# EAGLE design asserv (EAGLE 4.16)
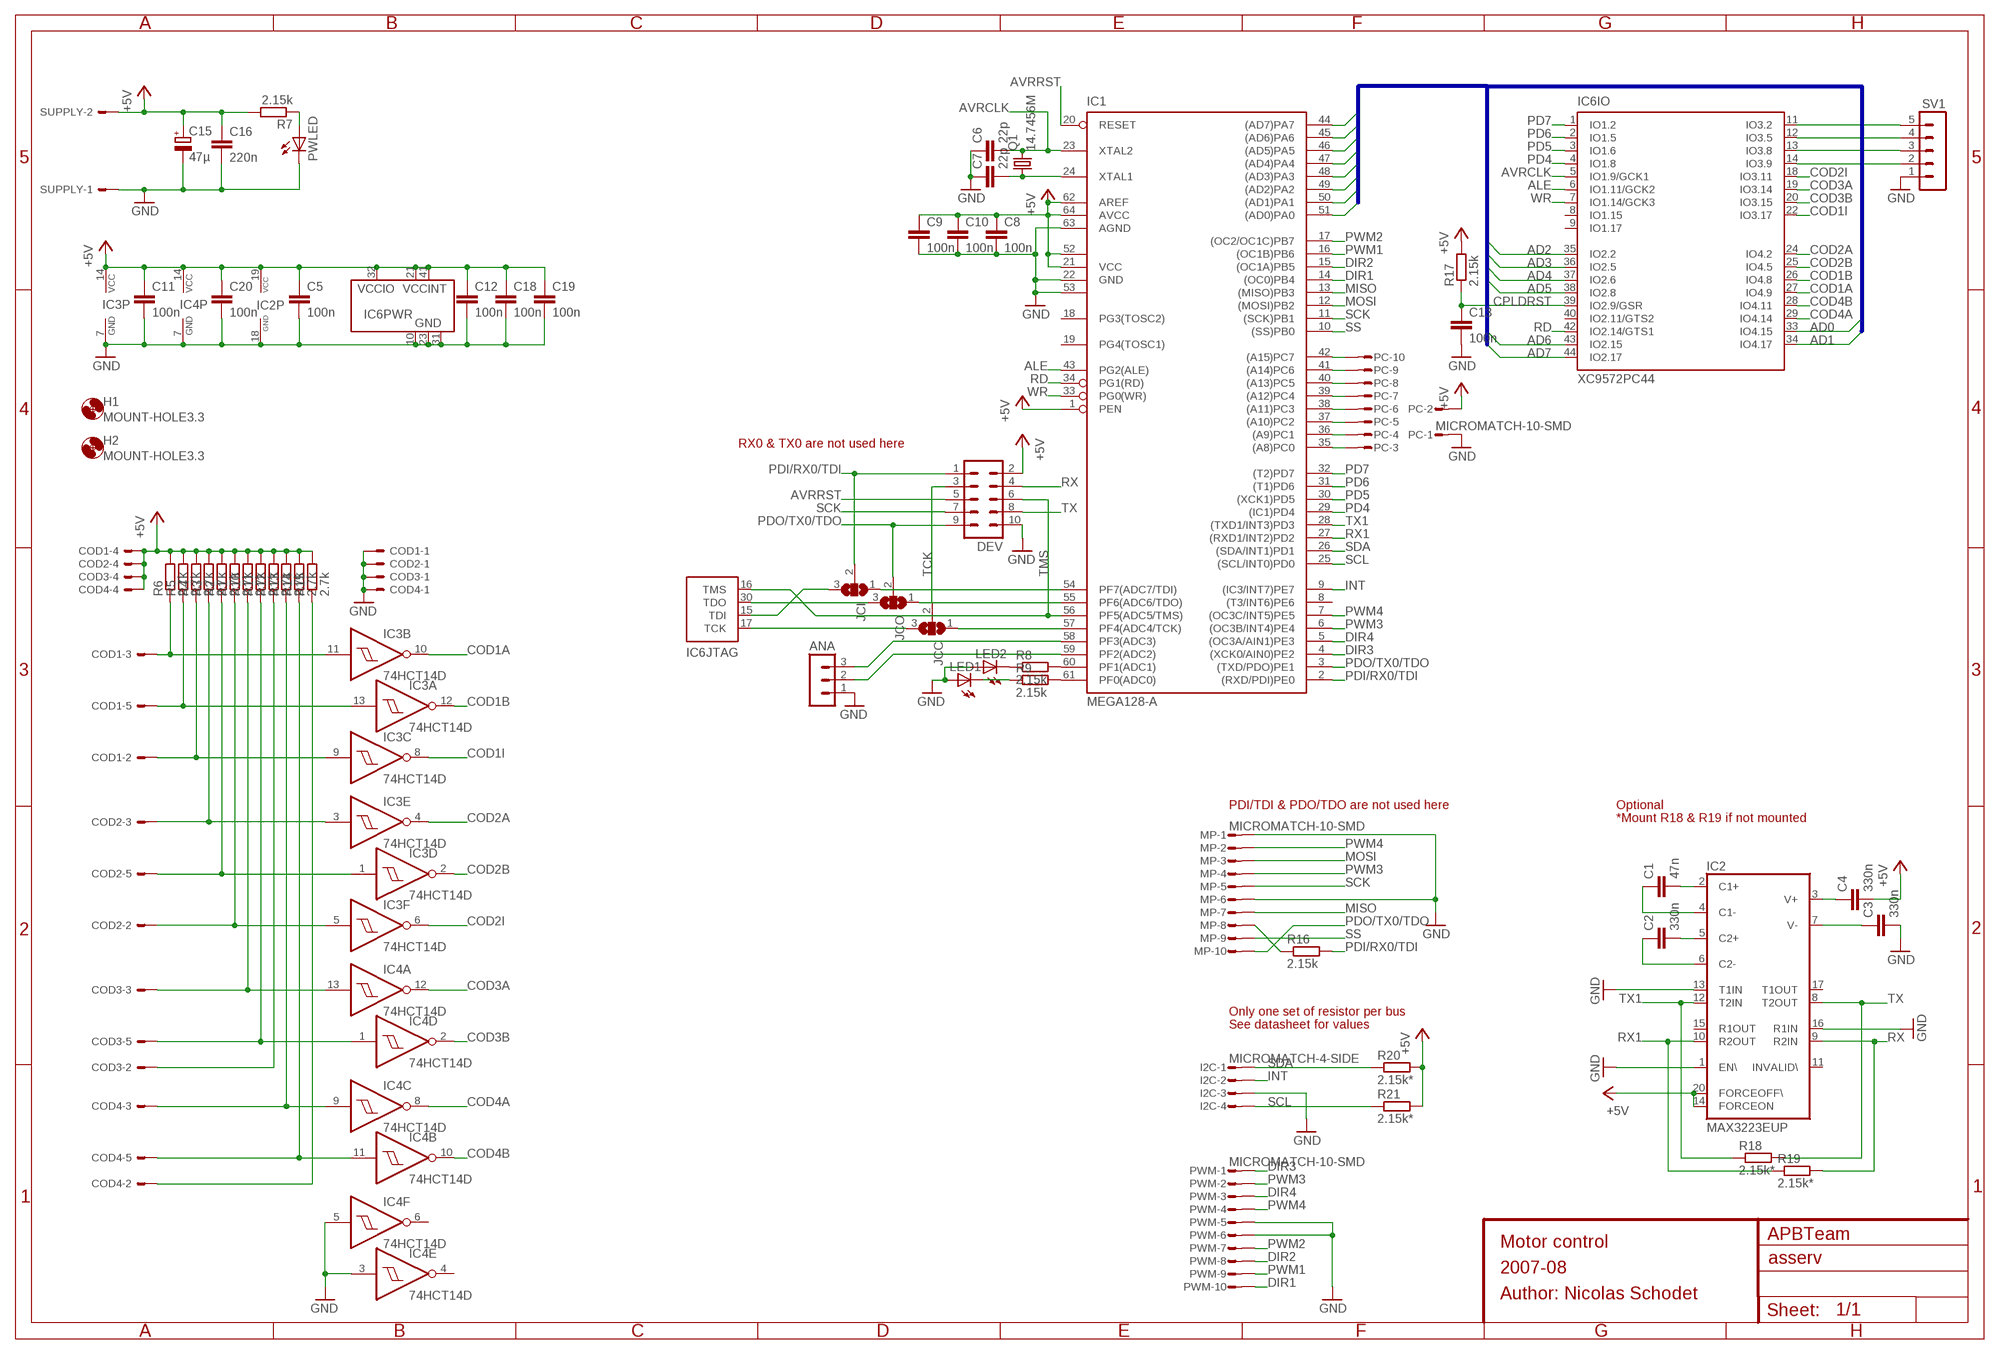
[diagram p0: schematic, sheet 1]

## Parts
ANA  MA03-1  [MA03-1]
C1  47n  C-EUC0603  [C0603]
C2  330n  C-EUC0603  [C0603]
C3  330n  C-EUC0603  [C0603]
C4  330n  C-EUC0603  [C0603]
C5  100n  C-EUC0603  [C0603]
C6  22p  C-EUC0603  [C0603]
C7  22p  C-EUC0603  [C0603]
C8  100n  C-EUC0603  [C0603]
C9  100n  C-EUC0603  [C0603]
C10  100n  C-EUC0603  [C0603]
C11  100n  C-EUC0603  [C0603]
C12  100n  C-EUC0603  [C0603]
C13  100n  C-EUC0603  [C0603]
C15  47µ  CPOL-EUC  [PANASONIC_C]
C16  220n  C-EUC0603  [C0603]
C18  100n  C-EUC0603  [C0603]
C19  100n  C-EUC0603  [C0603]
C20  100n  C-EUC0603  [C0603]
COD1  EC1X05  [EC1X05]
COD2  EC1X05  [EC1X05]
COD3  EC1X05  [EC1X05]
COD4  EC1X05  [EC1X05]
DEV  ML10L  [ML10L]
H1  MOUNT-HOLE3.3  [3,3]
H2  MOUNT-HOLE3.3  [3,3]
I2C  MICROMATCH-4-SIDE  [MICROMATCH-4-SIDE]
IC1  MEGA128-A  [TQFP64]
IC2  MAX3223EUP  [TSSOP20]
IC3  74HCT14D  [SO14]
IC4  74HCT14D  [SO14]
IC6  XC9572PC44  [PLCC44]
JCC  SJ2W  [SJ_2]
JCI  SJ2W  [SJ_2]
JCO  SJ2W  [SJ_2]
LED1  LEDSMT1206  [1206]
LED2  LEDSMT1206  [1206]
MP  MICROMATCH-10-SMD  [MICROMATCH-10-SMD]
PC  MICROMATCH-10-SMD  [MICROMATCH-10-SMD]
PWLED  LEDSMT1206  [1206]
PWM  MICROMATCH-10-SMD  [MICROMATCH-10-SMD]
Q1  14.7456M  CRYTALHC49U70  [HC49U70]
R1  2.7k  R-EU_R0603  [R0603]
R2  2.7k  R-EU_R0603  [R0603]
R3  2.7k  R-EU_R0603  [R0603]
R4  2.7k  R-EU_R0603  [R0603]
R5  2.7k  R-EU_R0603  [R0603]
R6  2.7k  R-EU_R0603  [R0603]
R7  2.15k  R-EU_R0603  [R0603]
R8  2.15k  R-EU_R0603  [R0603]
R9  2.15k  R-EU_R0603  [R0603]
R10  2.7k  R-EU_R0603  [R0603]
R11  2.7k  R-EU_R0603  [R0603]
R12  2.7k  R-EU_R0603  [R0603]
R13  2.7k  R-EU_R0603  [R0603]
R14  2.7k  R-EU_R0603  [R0603]
R15  2.7k  R-EU_R0603  [R0603]
R16  2.15k  R-EU_R0603  [R0603]
R17  2.15k  R-EU_R0603  [R0603]
R18  2.15k*  R-EU_R0603  [R0603]
R19  2.15k*  R-EU_R0603  [R0603]
R20  2.15k*  R-EU_R0603  [R0603]
R21  2.15k*  R-EU_R0603  [R0603]
SUPPLY  EC1X02  [EC1X02]
SV1  MA05-1  [MA05-1]

## Nets
+5V [supply]: C4.2 C5.1 C8.1 C9.1 C10.1 C11.1 C12.1 C15.+ C16.1 C18.1 C19.1 C20.1 COD1.4 COD2.4 COD3.4 COD4.4 DEV.2 IC1.1(PEN) IC1.21(VCC) IC1.52(VCC1) IC1.62(AREF) IC1.64(AVCC) IC2.14(FORCEON) IC2.19(VCC) IC2.20(FORCEOFF\) IC3.14(P:VCC) IC4.14(P:VCC) IC6.21(PWR:VCCINT) IC6.32(PWR:VCCIO) IC6.41(PWR:VCCINT) PC.2 R1.2 R2.2 R3.2 R4.2 R5.2 R6.2 R7.2 R10.2 R11.2 R12.2 R13.2 R14.2 R15.2 R17.2 R20.2 R21.2 SUPPLY.2
AD0: IC1.51((AD0)PA0) IC6.33(IO:IO4.15)
AD1: IC1.50((AD1)PA1) IC6.34(IO:IO4.17)
AD2: IC1.49((AD2)PA2) IC6.35(IO:IO2.2)
AD3: IC1.48((AD3)PA3) IC6.36(IO:IO2.5)
AD4: IC1.47((AD4)PA4) IC6.37(IO:IO2.6)
AD5: IC1.46((AD5)PA5) IC6.38(IO:IO2.8)
AD6: IC1.45((AD6)PA6) IC6.43(IO:IO2.15)
AD7: IC1.44((AD7)PA7) IC6.44(IO:IO2.17)
ALE: IC1.43(PG2(ALE)) IC6.6(IO:IO1.11/GCK2)
ATCK: IC1.57(PF4(ADC4/TCK)) JCC.1
ATDI: IC1.54(PF7(ADC7/TDI)) JCI.1
ATDO: IC1.55(PF6(ADC6/TDO)) JCO.1
AVRCLK: C6.2 IC1.23(XTAL2) IC6.5(IO:IO1.9/GCK1) Q1.2
AVRRST: DEV.5 IC1.20(RESET)
C0: IC1.35((A8)PC0) PC.3
C1: IC1.36((A9)PC1) PC.4
C2: IC1.37((A10)PC2) PC.5
C3: IC1.38((A11)PC3) PC.6
C4: IC1.39((A12)PC4) PC.7
C5: IC1.40((A13)PC5) PC.8
C6: IC1.41((A14)PC6) PC.9
C7: IC1.42((A15)PC7) PC.10
COD1A: IC3.10(B:O) IC6.27(IO:IO4.9)
COD1B: IC3.12(A:O) IC6.26(IO:IO4.8)
COD1I: IC3.8(C:O) IC6.22(IO:IO3.17)
COD2A: IC3.4(E:O) IC6.24(IO:IO4.2)
COD2B: IC3.2(D:O) IC6.25(IO:IO4.5)
COD2I: IC3.6(F:O) IC6.18(IO:IO3.11)
COD3A: IC4.12(A:O) IC6.19(IO:IO3.14)
COD3B: IC4.2(D:O) IC6.20(IO:IO3.15)
COD4A: IC4.8(C:O) IC6.29(IO:IO4.14)
COD4B: IC4.10(B:O) IC6.28(IO:IO4.11)
CPLDRST: C13.1 IC6.39(IO:IO2.9/GSR) R17.1
DIR1: IC1.14((OC0)PB4) PWM.10
DIR2: IC1.15((OC1A)PB5) PWM.8
DIR3: IC1.4((XCK0/AIN0)PE2) PWM.1
DIR4: IC1.5((OC3A/AIN1)PE3) PWM.3
GND [supply]: ANA.1 C3.2 C5.2 C6.1 C7.1 C8.2 C9.2 C10.2 C11.2 C12.2 C13.2 C15.- C16.2 C18.2 C19.2 C20.2 COD1.1 COD2.1 COD3.1 COD4.1 DEV.10 I2C.3 IC1.22(GND) IC1.53(GND1) IC1.63(AGND) IC2.1(EN\) IC2.13(T1IN) IC2.16(R1IN) IC2.18(GND) IC3.7(P:GND) IC4.3(E:I) IC4.5(F:I) IC4.7(P:GND) IC6.10(PWR:GND) IC6.23(PWR:GND) IC6.31(PWR:GND) LED1.A LED2.A MP.1 MP.6 PC.1 PWLED.C PWM.5 PWM.6 SUPPLY.1 SV1.1
INT: I2C.2 IC1.9((IC3/INT7)PE7)
MC1+: C1.2 IC2.2(C1+)
MC1-: C1.1 IC2.4(C1-)
MC2+: C2.2 IC2.5(C2+)
MC2-: C2.1 IC2.6(C2-)
MISO: IC1.13((MISO)PB3) MP.7
MOSI: IC1.12((MOSI)PB2) MP.3
MV+: C4.1 IC2.3(V+)
MV-: C3.1 IC2.7(V-)
N$1: PWLED.A R7.1
N$2: IC1.60(PF1(ADC1)) R8.2
N$4: ANA.3 IC1.58(PF3(ADC3))
N$5: ANA.2 IC1.59(PF2(ADC2))
N$6: IC6.11(IO:IO3.2) SV1.5
N$7: IC6.12(IO:IO3.5) SV1.4
N$8: COD3.3 IC4.13(A:I) R10.1
N$9: IC6.13(IO:IO3.8) SV1.3
N$10: COD3.5 IC4.1(D:I) R11.1
N$11: C7.2 IC1.24(XTAL1) Q1.1
N$12: COD3.2 R12.1
N$13: IC6.14(IO:IO3.9) SV1.2
N$14: LED2.C R8.1
N$15: IC1.61(PF0(ADC0)) R9.2
N$16: LED1.C R9.1
N$18: COD2.2 IC3.5(F:I) R1.1
N$19: COD1.2 IC3.9(C:I) R4.1
N$21: COD1.3 IC3.11(B:I) R6.1
N$22: COD1.5 IC3.13(A:I) R5.1
N$23: COD2.3 IC3.3(E:I) R3.1
N$24: COD2.5 IC3.1(D:I) R2.1
N$32: COD4.3 IC4.9(C:I) R13.1
N$33: COD4.5 IC4.11(B:I) R14.1
N$41: COD4.2 R15.1
PD4: IC1.29((IC1)PD4) IC6.4(IO:IO1.8)
PD5: IC1.30((XCK1)PD5) IC6.3(IO:IO1.6)
PD6: IC1.31((T1)PD6) IC6.2(IO:IO1.5)
PD7: IC1.32((T2)PD7) IC6.1(IO:IO1.2)
PDI/RX0/TDI: DEV.1 IC1.2((RXD/PDI)PE0) JCI.2 R16.2
PDO/TX0/TDO: DEV.9 IC1.3((TXD/PDO)PE1) JCO.2 MP.10
PWM1: IC1.16((OC1B)PB6) PWM.9
PWM2: IC1.17((OC2/OC1C)PB7) PWM.7
PWM3: IC1.6((OC3B/INT4)PE4) MP.4 PWM.2
PWM4: IC1.7((OC3C/INT5)PE5) MP.2 PWM.4
RD: IC1.34(PG1(RD)) IC6.42(IO:IO2.14/GTS1)
RX: DEV.4 IC2.9(R2IN) R19.2
RX1: IC1.27((RXD1/INT2)PD2) IC2.10(R2OUT) R19.1
SCK: DEV.7 IC1.11((SCK)PB1) MP.5
SCL: I2C.4 IC1.25((SCL/INT0)PD0) R21.1
SDA: I2C.1 IC1.26((SDA/INT1)PD1) R20.1
SS: IC1.10((SS)PB0) MP.9
TCK: DEV.3 JCC.2
TMS: DEV.6 IC1.56(PF5(ADC5/TMS)) IC6.16(JTAG:TMS)
TX: DEV.8 IC2.8(T2OUT) R18.2
TX1: IC1.28((TXD1/INT3)PD3) IC2.12(T2IN) R18.1
TX_SLAVE: MP.8 R16.1
WR: IC1.33(PG0(WR)) IC6.7(IO:IO1.14/GCK3)
XTCK: IC6.17(JTAG:TCK) JCC.3
XTDI: IC6.15(JTAG:TDI) JCI.3
XTDO: IC6.30(JTAG:TDO) JCO.3
Unconnected: IC1.8((T3/INT6)PE6) IC1.18(PG3(TOSC2)) IC1.19(PG4(TOSC1)) IC2.11(INVALID\) IC2.15(R1OUT) IC2.17(T1OUT) IC4.4(E:O) IC4.6(F:O) IC6.8(IO:IO1.15) IC6.9(IO:IO1.17) IC6.40(IO:IO2.11/GTS2)

## Buses
AD[0..7]

## Notes on the sheet
- RX0 & TX0 are not used here
- PDI/TDI & PDO/TDO are not used here | Optional
- *Mount R18 & R19 if not mounted
- Only one set of resistor per bus
- See datasheet for values
- APBTeam
- Motor control
- 2007-08
- Author: Nicolas Schodet

## Library data of the parts
ANA = con-lstb:MA03-1: PIN HEADER
C1-C13 C16 C18-C20 = rcl:C-EU: CAPACITOR, European symbol
C15 = rcl:CPOL-EU: POLARIZED CAPACITOR, European symbol
COD1-COD4 = apbteam_con-amp-he14:E?1X05: Male header simple row, 5 positions
DEV = con-harting-ml:ML10: HARTING
H1 H2 = holes:MOUNT-HOLE: MOUNTING HOLE with drill center marker
I2C = apbteam_con-amp-micromatch:MICROMATCH-4: MicroMaTch 4
IC1 = robot_avr:MEGA128: MICROCONTROLLER 128 Kbytes FLASH 4 Kbytes SRAM 4 Kbytes EEPROM DUAL USART 8-channel 10 bit ADC
IC2 = maxim:MAX3223*: RS-232 Transceivers with AutoShutdown 1µA Supply-Current, True +3V to +5.5V http://dbserv.maxim-ic.com/
IC3 IC4 = 74xx-eu:74*14: Hex schmitt trigger INVERTER
IC6 = apbteam_xilinx-cpld:XC9572*PC44: XC9572 In-System Programmable CPLD 72 macrocells
JCC JCI JCO = jumper:SJ2W: SMD solder JUMPER
LED1 LED2 PWLED = led:LED: LED OSRAM: - CHIPLED LG R971, LG N971, LY N971, LG Q971, LY Q971, LO R971, LY R971 LH N974, LH R974 LS Q976, LO Q976, LY Q976 LO Q996 - Hyper CHIPLED LW Q18S LB Q993, LB Q99A, LB R99A - SideLED LS A670, LO A670, LY A670, LG A670, LP A670 LB A673, LV A673, LT A673, LW A673 LH A674 LY A675 LS A676, LA A676, LO A676, LY A676, LW A676 LS A679, LY A679, LG A679 - Hyper Micro SIDELED® LS Y876, LA Y876, LO Y876, LY Y876 LT Y87S - SmartLED LW L88C, LW L88S LB L89C, LB L89S, LG L890 LS L89K, LO L89K, LY L89K LS L896, LA L896, LO L896, LY L896 - TOPLED LS T670, LO T670, LY T670, LG T670, LP T670 LSG T670, LSP T670, LSY T670, LOP T670, LYG T670 LG T671, LOG T671, LSG T671 LB T673, LV T673, LT T673, LW T673 LH T674 LS T676, LA T676, LO T676, LY T676, LB T676, LH T676, LSB T676, LW T676 LB T67C, LV T67C, LT T67C, LS T67K, LO T67K, LY T67K, LW E67C LS E67B, LA E67B, LO E67B, LY E67B, LB E67C, LV E67C, LT E67C LW T67C LS T679, LY T679, LG T679 LS T770, LO T770, LY T770, LG T770, LP T770 LB T773, LV T773, LT T773, LW T773 LH T774 LS E675, LA E675, LY E675, LS T675 LS T776, LA T776, LO T776, LY T776, LB T776 LHGB T686 LT T68C, LB T68C - Hyper Mini TOPLED® LB M676 - Mini TOPLED Santana® LG M470 LS M47K, LO M47K, LY M47K Source: http://www.osram.convergy.de/
MP PC PWM = apbteam_con-amp-micromatch:MICROMATCH-10: MicroMaTch 10
Q1 = crystal:CRYTAL: CRYSTAL
R1-R21 = rcl:R-EU_: RESISTOR, European symbol
SUPPLY = apbteam_con-amp-he14:E?1X02: Male header simple row, 2 positions
SV1 = con-lstb:MA05-1: PIN HEADER

## Net classes
1 supply: width 0.254 mm

## Board
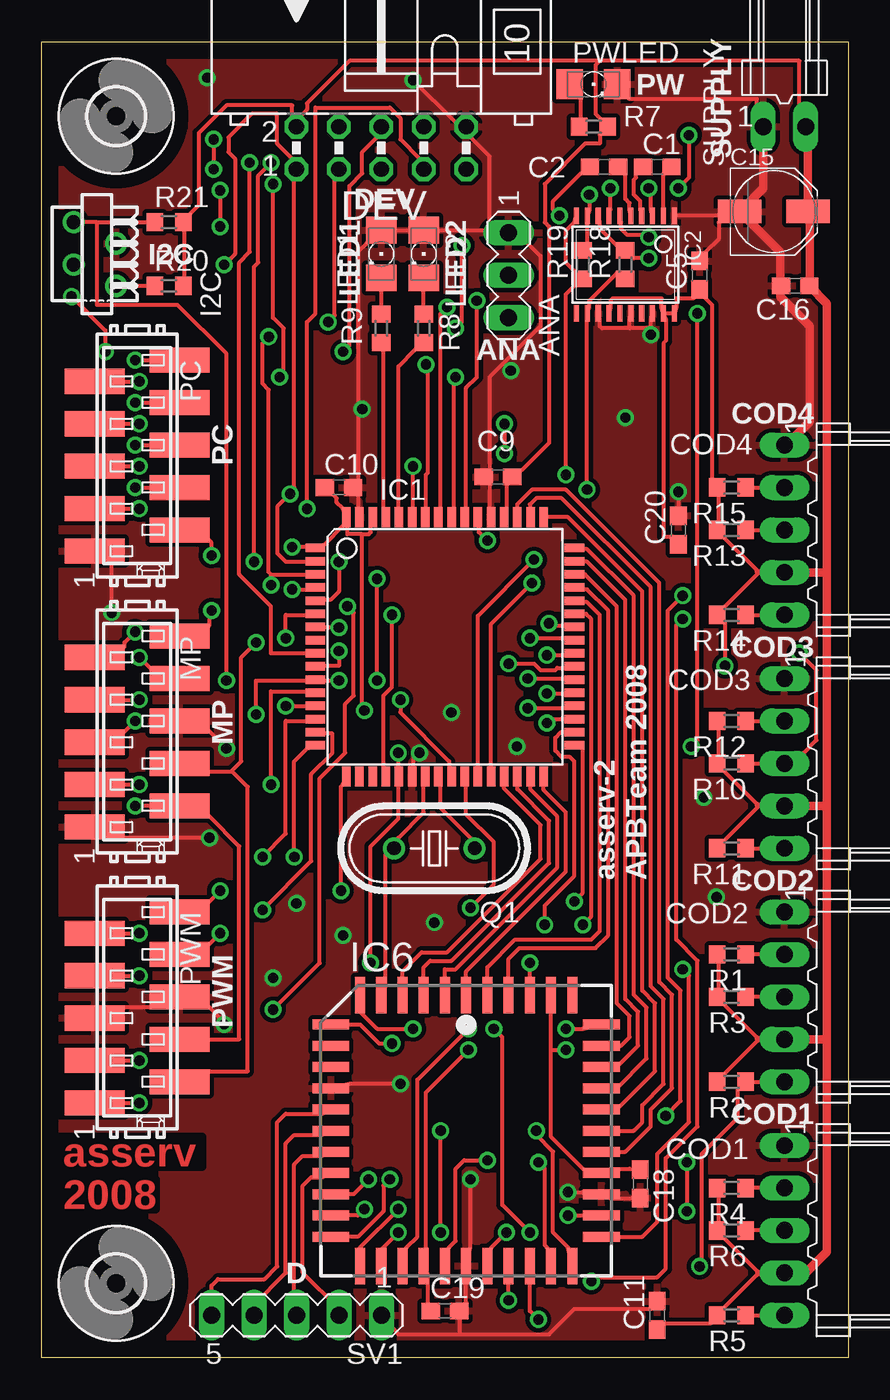
[diagram p1: board, top side]
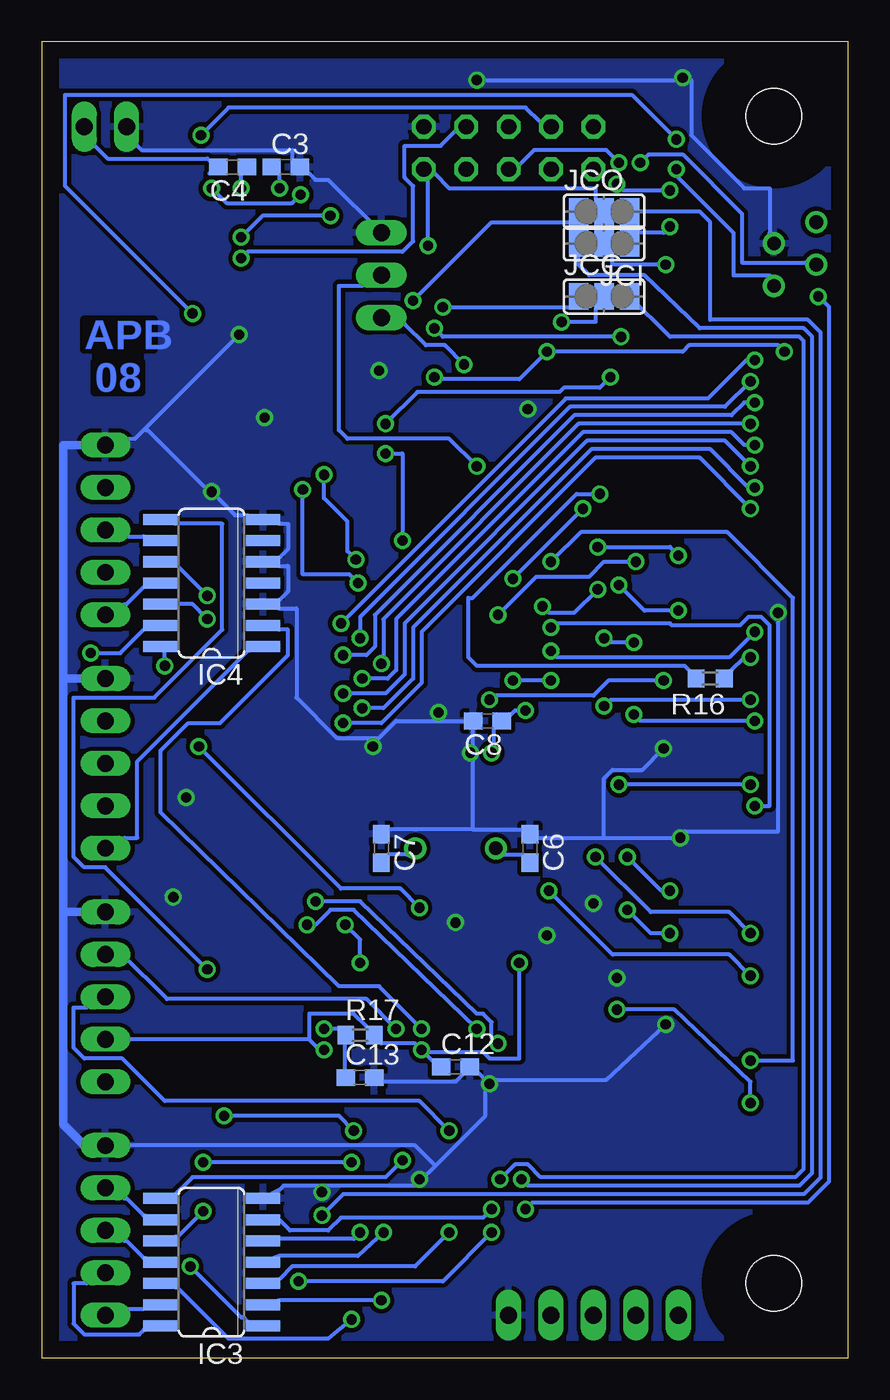
[diagram p2: board, bottom side, seen from below]

Size 48.26 x 78.74 mm. Coordinates in mm from the lower left corner, seen from the top.
Outline: 0,0 0,78.74 48.26,78.74 48.26,0 0,0
Copper layers (1*16): Top 0.035mm / dielectric 1.5mm / Bottom 0.035mm
Design rules "10mils": minimum track width 10mil, minimum drill 24mil, track to track 10mil, track to pad 10mil, pad to pad 10mil, via to via 10mil, smd to smd 10mil, copper to edge 40mil, drill to drill 10mil, minimum pad ring 10mil, minimum via ring 8mil, stop-mask expansion 0mil, vias tented up to drill 0mil, thermal gap 10mil

### Footprints (pad centres in the part's own frame; a part is rotated, then mirrored left to right if it is on the bottom)
MA03-1 = drill 1.016 long: 1 -2.54,0; 2 0,0; 3 2.54,0
C0603 = smd 1.1 x 1: 1 -0.85,0; 2 0.85,0
PANASONIC_C = smd 2.6 x 1.4: + 2.05,0; - -2.05,0
EC1X05 = drill 1 long: 1 -5.08,0; 2 -2.54,0; 3 0,0; 4 2.54,0; 5 5.08,0
ML10L = drill 0.914 octagon: 1 -5.08,-1.27; 2 -5.08,1.27; 3 -2.54,-1.27; 4 -2.54,1.27; 5 0,-1.27; 6 0,1.27; 7 2.54,-1.27; 8 2.54,1.27; 9 5.08,-1.27; 10 5.08,1.27
3,3 = hole 3.3: 0,0
MICROMATCH-4-SIDE = drill 0.813 round: 1 1.905,1.27; 2 0.635,-1.27; 3 -0.635,1.27; 4 -1.905,-1.27
TQFP64 = smd 1.194 x 0.508: 1 -7.76,5.905; 2 -7.76,5.118; 3 -7.76,4.331; 4 -7.76,3.543; 5 -7.76,2.756; 6 -7.76,1.968; 7 -7.76,1.181; 8 -7.76,0.394; 9 -7.76,-0.394; 10 -7.76,-1.181; 11 -7.76,-1.968; 12 -7.76,-2.756; 13 -7.76,-3.543; 14 -7.76,-4.331; 15 -7.76,-5.118; 16 -7.76,-5.905; 33 7.76,-5.905; 34 7.76,-5.118; 35 7.76,-4.331; 36 7.76,-3.543; 37 7.76,-2.756; 38 7.76,-1.968; 39 7.76,-1.181; 40 7.76,-0.394; 41 7.76,0.394; 42 7.76,1.181; 43 7.76,1.968; 44 7.76,2.756; 45 7.76,3.543; 46 7.76,4.331; 47 7.76,5.118; 48 7.76,5.905 | smd 0.508 x 1.194: 17 -5.905,-7.76; 18 -5.118,-7.76; 19 -4.331,-7.76; 20 -3.543,-7.76; 21 -2.756,-7.76; 22 -1.968,-7.76; 23 -1.181,-7.76; 24 -0.394,-7.76; 25 0.394,-7.76; 26 1.181,-7.76; 27 1.968,-7.76; 28 2.756,-7.76; 29 3.543,-7.76; 30 4.331,-7.76; 31 5.118,-7.76; 32 5.905,-7.76; 49 5.905,7.76; 50 5.118,7.76; 51 4.331,7.76; 52 3.543,7.76; 53 2.756,7.76; 54 1.968,7.76; 55 1.181,7.76; 56 0.394,7.76; 57 -0.394,7.76; 58 -1.181,7.76; 59 -1.968,7.76; 60 -2.756,7.76; 61 -3.543,7.76; 62 -4.331,7.76; 63 -5.118,7.76; 64 -5.905,7.76
TSSOP20 = smd 0.305 x 0.991: 1 -2.925,-2.918; 2 -2.275,-2.918; 3 -1.625,-2.918; 4 -0.975,-2.918; 5 -0.325,-2.918; 6 0.325,-2.918; 7 0.975,-2.918; 8 1.625,-2.918; 9 2.275,-2.918; 10 2.925,-2.918; 11 2.925,2.918; 12 2.275,2.918; 13 1.625,2.918; 14 0.975,2.918; 15 0.325,2.918; 16 -0.325,2.918; 17 -0.975,2.918; 18 -1.625,2.918; 19 -2.275,2.918; 20 -2.925,2.918
SO14 = smd 0.66 x 2.032: 1 -3.81,-3.073; 2 -2.54,-3.073; 3 -1.27,-3.073; 4 0,-3.073; 5 1.27,-3.073; 6 2.54,-3.073; 7 3.81,-3.073; 8 3.81,3.073; 9 2.54,3.073; 10 1.27,3.073; 11 0,3.073; 12 -1.27,3.073; 13 -2.54,3.073; 14 -3.81,3.073
PLCC44 = smd 0.6 x 2.2: 1 0,8.1; 2 -1.27,8.1; 3 -2.54,8.1; 4 -3.81,8.1; 5 -5.08,8.1; 6 -6.35,8.1; 18 -6.35,-8.1; 19 -5.08,-8.1; 20 -3.81,-8.1; 21 -2.54,-8.1; 22 -1.27,-8.1; 23 0,-8.1; 24 1.27,-8.1; 25 2.54,-8.1; 26 3.81,-8.1; 27 5.08,-8.1; 28 6.35,-8.1; 40 6.35,8.1; 41 5.08,8.1; 42 3.81,8.1; 43 2.54,8.1; 44 1.27,8.1 | smd 2.2 x 0.6: 7 -8.1,6.35; 8 -8.1,5.08; 9 -8.1,3.81; 10 -8.1,2.54; 11 -8.1,1.27; 12 -8.1,0; 13 -8.1,-1.27; 14 -8.1,-2.54; 15 -8.1,-3.81; 16 -8.1,-5.08; 17 -8.1,-6.35; 29 8.1,-6.35; 30 8.1,-5.08; 31 8.1,-3.81; 32 8.1,-2.54; 33 8.1,-1.27; 34 8.1,0; 35 8.1,1.27; 36 8.1,2.54; 37 8.1,3.81; 38 8.1,5.08; 39 8.1,6.35
SJ_2 = smd 1.168 x 1.6: 1 -1.524,0; 2 0,0; 3 1.524,0
1206 = smd 1.6 x 1.803: A -1.422,0; C 1.422,0
MICROMATCH-10-SMD = smd 1.5 x 3.58: 1 5.715,-2.54; 2 4.445,2.54; 3 3.175,-2.54; 4 1.905,2.54; 5 0.635,-2.54; 6 -0.635,2.54; 7 -1.905,-2.54; 8 -3.175,2.54; 9 -4.445,-2.54; 10 -5.715,2.54
HC49U70 = drill 0.813 round: 1 -2.413,0; 2 2.413,0
R0603 = smd 1 x 1.1: 1 -0.85,0; 2 0.85,0
EC1X02 = drill 1 long: 1 -1.27,0; 2 1.27,0
MA05-1 = drill 1.016 long: 1 -5.08,0; 2 -2.54,0; 3 0,0; 4 2.54,0; 5 5.08,0

### Placement (x,y rotation side)
ANA  27.94,64.77 270 top
C1  36.83,71.25 0 top
C2  33.66,71.25 0 top
C3  33.66,71.25 0 bottom
C4  36.83,71.25 180 bottom
C5  39.37,64.77 90 top
C6  19.05,30.48 270 bottom
C7  27.94,30.48 270 bottom
C8  21.59,38.1 180 bottom
C9  27.3,52.7 180 top
C10  17.78,52.07 0 top
C11  36.83,2.54 90 top
C12  23.5,17.4 0 bottom
C13  29.21,16.76 0 bottom
C15  43.81,68.58 0 top
C16  45.09,64.14 180 top
C18  35.81,10.41 270 top
C19  24.13,2.79 0 top
C20  38.1,49.53 90 top
COD1  44.45,7.62 270 top
COD2  44.45,21.59 270 top
COD3  44.45,35.56 270 top
COD4  44.45,49.53 270 top
DEV  20.32,72.39 0 top
H1  4.45,74.3 0 top
H2  4.45,4.45 0 top
I2C  3.17,66.04 270 top
IC1  24.13,42.55 0 top
IC2  34.92,65.41 180 top
IC3  38.1,5.71 90 bottom
IC4  38.1,46.35 90 bottom
IC6  25.4,13.59 0 top
JCC  14.61,63.5 0 bottom
JCI  14.61,66.67 180 bottom
JCO  14.61,68.58 0 bottom
LED1  20.32,66.04 270 top
LED2  22.86,66.04 270 top
MP  5.71,37.47 270 top
PC  5.71,53.98 270 top
PWLED  33.02,76.2 0 top
PWM  5.71,20.95 270 top
Q1  23.5,30.48 180 top
R1  41.27,24.13 180 top
R2  41.27,16.51 180 top
R3  41.27,21.59 180 top
R4  41.27,10.16 180 top
R5  41.27,2.54 180 top
R6  41.27,7.62 180 top
R7  33.02,73.66 0 top
R8  22.86,61.59 270 top
R9  20.32,61.59 270 top
R10  41.27,35.56 180 top
R11  41.27,30.48 180 top
R12  41.27,38.1 180 top
R13  41.27,49.53 180 top
R14  41.27,44.45 180 top
R15  41.27,52.07 180 top
R16  8.26,40.64 180 bottom
R17  29.21,19.3 0 bottom
R18  34.92,65.41 90 top
R19  32.38,65.41 90 top
R20  7.62,64.14 0 top
R21  7.62,67.94 0 top
SUPPLY  44.45,73.66 0 top
SV1  15.24,2.54 180 top

### Tracks (layer width: path | path; a pad name or v marks a point on that pad's centre or on a via)
+5V  (via drill 0.61)
  Top 0.254: v21.34,36.2 21.34,35.31 IC1.21 21.34,34.29 21.34,32.26 19.68,30.61 v19.68,23.62 | C10.1 17.4,51.69 17.65,51.44 17.65,51.18 18.03,50.8 IC1.64 | IC1.64 18.03,49.78 16.89,48.64 IC1.1 15.88,48.51 v14.99,48.51 | 19.18,49.28 18.29,49.28 18.29,49.78 IC1.64 | 19.18,49.28 19.56,49.28 19.68,49.4 19.68,49.78 IC1.62 | v19.3,38.73 19.18,38.86 19.18,49.28 | v10.16,48.01 10.16,48.77 10.03,48.9 PC.2 | C18.1 35.18,11.3 34.04,11.3 IC6.32 32.38,11.3 30.48,13.21 30.48,18.41 | 30.48,18.41 IC6.41 | C19.1 23.11,3.3 23.11,4.95 IC6.21 22.99,6.6 22.99,15.88 v25.53,18.41 | 30.48,18.41 v31.37,18.41 | IC2.14 34.04,62.87 34.04,63.25 34.16,63.37 37.08,63.37 37.08,62.87 IC2.19 | IC2.19 37.34,62.48 37.72,62.48 IC2.20 37.97,62.87 37.97,63.37 38.99,63.37 C5.1 39.75,63.37 40.13,62.99 40.13,52.58 R15.2 40.51,51.56 40.51,50.04 R13.2 40.89,49.02 42.8,47.12 42.8,46.99 42.86,46.93 | C20.1 37.72,49.15 37.21,49.15 37.21,60.71 37.34,60.83 37.34,62.1 IC2.19 | R20.2 8.51,64.64 8.51,67.44 R21.2 8.89,68.45 9.4,68.96 9.4,73.28 11.05,74.93 14.99,74.93 14.99,74.3 DEV.2 15.49,74.3 15.88,74.68 15.88,75.06 18.41,77.6 33.27,77.6 33.34,77.53 | C11.1 37.21,2.03 40.01,2.03 R5.2 40.89,3.05 42.8,4.95 42.8,5.08 42.86,5.14 | IC1.52 27.81,50.8 27.81,52.32 C9.1 28.7,53.09 30.35,54.74 30.35,67.69 30.1,67.94 30.1,70.23 32.51,72.64 33.4,72.64 33.4,73.15 R7.2 33.4,74.17 33.15,74.42 33.15,77.34 33.34,77.53 | R12.2 40.51,37.59 40.51,36.07 R10.2 40.89,35.05 42.8,33.15 42.8,33.02 42.86,32.96 | R1.2 40.51,23.62 40.51,22.1 R3.2 40.89,21.08 42.8,19.18 42.8,19.05 42.86,18.99 | R4.2 40.51,9.65 40.51,8.13 R6.2 40.89,7.11 42.86,5.14
  Top 0.254: 42.86,18.99 43.05,19.18 COD2.4 | 42.86,18.99 40.89,17.02 R2.2 | 42.86,32.96 43.05,33.15 COD3.4 | 42.86,32.96 40.89,30.99 R11.2 | 42.86,46.93 43.05,47.12 COD4.4 | 42.86,46.93 40.89,44.96 R14.2 40.89,43.94 v40.89,41.4 | 33.34,77.53 33.4,77.6 45.34,77.6 45.34,75.06 SUPPLY.2 | 42.86,5.14 43.05,4.95 COD1.4
  Top 0.508: 46.99,46.99 COD4.4 | 46.99,33.02 46.99,46.99 | 46.99,33.02 COD3.4 | 46.99,19.05 46.99,33.02 | COD2.4 46.99,19.05 | 46.99,19.05 46.99,6.35 45.72,5.08 COD1.4 | SUPPLY.2 45.85,73.66 45.85,68.58 C15.+ 45.97,68.47 45.97,64.14 C16.1 46.99,63.08 46.99,46.99
  Bottom 0.254: v21.34,36.2 21.21,36.2 21.21,37.72 C8.1 20.19,38.48 19.94,38.73 v19.3,38.73 | v10.16,48.01 10.67,48.51 v14.99,48.51 | v25.53,18.41 25.91,18.8 27.94,18.8 R17.2 28.83,19.81 29.59,20.57 32.26,20.57 32.26,19.05 | v25.53,18.41 24.89,17.78 C12.1 | 38.23,70.87 C4.2 38.23,71.63 38.35,71.75 44.32,71.75 45.09,72.52 SUPPLY.2 | IC3.14 42.16,1.65 42.42,1.4 45.72,1.4 46.35,2.03 46.35,4.45 45.59,4.45 COD1.4 | v40.89,41.4 40.89,42.29 IC4.14 | 32.26,19.05 COD2.4 | v19.68,23.62 19.68,17.91 21.46,17.91 21.84,18.29 25.15,18.29 v25.53,18.41 | v31.37,18.41 31.62,18.41 32.26,19.05
AD0
  Top 0.254: IC6.33 34.92,12.32 36.45,13.84 36.45,14.86 37.72,16.13 37.72,21.72 36.96,22.48 36.96,46.35 31.37,51.94 29.34,51.94 28.45,51.05 28.45,50.29 IC1.51
AD1
  Top 0.254: IC6.34 35.43,13.59 35.94,14.1 35.94,15.11 37.21,16.38 37.21,21.46 36.45,22.23 36.45,46.1 31.11,51.44 29.59,51.44 29.21,51.05 29.21,50.29 29.22,50.3 IC1.50
AD2
  Top 0.254: IC6.35 34.42,14.86 36.7,17.14 36.7,21.21 35.94,21.97 35.94,45.85 31.5,50.29 30.1,50.29 30.09,50.3 IC1.49
AD3
  Top 0.254: IC6.36 34.42,16.13 36.2,17.91 36.2,20.95 35.43,21.72 35.43,45.59 32.64,48.39 31.88,48.39 31.89,48.4 IC1.48
AD4
  Top 0.254: IC6.37 34.42,17.4 35.69,18.67 35.69,20.7 34.92,21.46 34.92,45.34 32.64,47.62 31.88,47.62 31.89,47.64 IC1.47
AD5
  Top 0.254: IC6.38 34.67,18.67 35.18,19.18 35.18,20.45 34.42,21.21 34.42,44.96 32.51,46.86 31.88,46.86 IC1.46
AD6
  Top 0.254: IC6.43 27.94,23.88 28.57,24.51 33.15,24.51 33.91,25.27 33.91,44.7 32.64,45.97 31.88,45.97 31.89,45.99 IC1.45
AD7
  Top 0.254: IC1.44 31.98,45.21 32.64,45.21 33.4,44.45 33.4,25.53 32.89,25.02 28.32,25.02 26.67,23.37 IC6.44
ALE  (via drill 0.61)
  Top 0.254: IC1.43 32.58,44.51 32.89,44.2 32.89,26.42 v32.38,25.91 | 18.92,21.46 18.94,21.45 IC6.6 19.05,20.7 20.07,19.68 v22.23,19.68
  Bottom 0.254: v32.38,25.91 31.88,25.91 30.99,26.8 29.59,26.8 v22.23,19.68
ATCK  (via drill 0.61)
  Top 0.254: v24.26,62.87 23.88,62.48 23.88,50.8 IC1.57
  Bottom 0.254: v24.26,62.87 16.64,62.87 JCC.1
ATDI  (via drill 0.61)
  Top 0.254: v26.67,48.9 26.16,49.4 26.16,49.78 IC1.54 | v27.69,55.88 v27.69,54.1 | v14.22,58.67 14.48,58.93 14.48,61.59 13.84,62.23 v13.84,70.23 | v10.67,69.85 v10.67,67.69
  Bottom 0.254: v26.67,48.9 26.67,54.1 v27.69,54.1 | v27.69,55.88 25.78,57.78 17.27,57.78 17.02,58.04 14.86,58.04 v14.22,58.67 | v13.84,70.23 13.46,69.85 v10.67,69.85 | v10.67,67.69 11.05,67.31 12.57,67.31 JCI.1
ATDO  (via drill 0.61)
  Top 0.254: v26.04,63.25 26.04,58.67 25.4,58.04 25.4,50.8 IC1.55
  Bottom 0.254: v26.04,63.25 21.34,67.94 16.64,67.94 JCO.1
AVRCLK
  Top 0.254: IC1.23 22.86,34.29 22.86,32.64 21.34,31.11 Q1.2 20.57,30.1 20.57,22.23 IC6.5
  Bottom 0.254: C6.2 19.43,30.1 20.57,30.1 Q1.2
AVRRST  (via drill 0.61)
  Top 0.254: v20.95,44.45 20.95,40.13 20.45,39.62 20.45,35.31 IC1.20 | v12.7,47.62 12.7,65.28 12.95,65.53 12.95,70.74 v13.72,71.5
  Bottom 0.254: v20.95,44.45 18.67,46.74 15.49,46.74 14.61,47.62 v12.7,47.62 | v13.72,71.5 14.48,72.26 18.8,72.26 19.68,71.37 DEV.5
C0  (via drill 0.61)
  Top 0.254: v30.23,37.97 30.48,38.23 31.11,38.23 31.13,38.21 IC1.35 | PC.3 v5.84,50.8
  Bottom 0.254: v30.23,37.97 27.94,37.97 25.53,40.39 25.53,43.43 15.11,53.85 8.89,53.85 v5.84,50.8
C1  (via drill 0.61)
  Top 0.254: IC1.36 32.03,38.86 v29.08,38.86 | v5.59,52.07 PC.4
  Bottom 0.254: v29.08,38.86 27.81,38.86 26.04,40.64 26.04,43.69 15.37,54.36 8.26,54.36 5.97,52.07 v5.59,52.07
C2  (via drill 0.61)
  Top 0.254: v30.23,39.75 31.37,39.75 IC1.37 | PC.5 v5.84,53.34
  Bottom 0.254: v30.23,39.75 27.69,39.75 26.54,40.89 26.54,43.94 15.62,54.86 7.37,54.86 v5.84,53.34
C3  (via drill 0.61)
  Top 0.254: v29.08,40.64 31.37,40.64 IC1.38 | v5.59,54.61 PC.6
  Bottom 0.254: v29.08,40.64 27.56,40.64 27.05,41.15 27.05,44.2 15.88,55.37 6.99,55.37 6.22,54.61 v5.59,54.61
C4  (via drill 0.61)
  Top 0.254: PC.7 v5.84,55.88 | IC1.39 31.8,41.27 30.86,41.27 30.73,41.15 29.84,41.15 29.46,41.53 v27.94,41.53
  Bottom 0.254: v5.84,55.88 16.13,55.88 27.81,44.2 27.81,41.66 v27.94,41.53
C5  (via drill 0.61)
  Top 0.254: v30.23,42.04 31.37,42.04 IC1.40 | v5.59,57.15 PC.8
  Bottom 0.254: v30.23,42.04 28.83,42.04 28.32,42.55 28.32,44.45 16.38,56.39 6.99,56.39 6.22,57.15 v5.59,57.15
C6  (via drill 0.61)
  Top 0.254: IC1.41 31.77,43.05 v29.21,43.05 | PC.9 v5.84,58.42
  Bottom 0.254: v29.21,43.05 29.21,44.32 16.64,56.9 7.37,56.9 v5.84,58.42
C7  (via drill 0.61)
  Top 0.254: IC1.42 31.8,43.81 30.48,43.81 v30.35,43.94 | v5.59,59.69 PC.10
  Bottom 0.254: v30.35,43.94 16.89,57.4 8.38,57.4 6.1,59.69 v5.59,59.69
COD1A  (via drill 0.61)
  Top 0.254: v29.72,11.68 30.1,11.3 30.1,6.73 30.23,6.6 IC6.27 | v38.61,11.68 v38.61,8.76
  Bottom 0.254: v29.72,11.68 v38.61,11.68 | v38.61,8.76 40.13,7.24 40.26,7.24 IC3.10
COD1B  (via drill 0.61)
  Top 0.254: v29.72,2.29 29.21,2.79 IC6.26
  Bottom 0.254: v29.72,2.29 31.11,1.14 37.08,1.14 40.13,4.19 40.26,4.19 IC3.12
COD1I  (via drill 0.61)
  Top 0.254: v26.67,11.81 25.27,11.81 24.77,11.3 24.77,6.99 24.38,6.6 IC6.22
  Bottom 0.254: v26.67,11.81 27.69,10.79 39.24,10.79 40.51,9.53 IC3.8
COD2A  (via drill 0.61)
  Top 0.254: v27.81,7.49 26.92,6.6 IC6.24
  Bottom 0.254: v27.81,7.49 29.34,6.1 34.04,6.1 IC3.4
COD2B  (via drill 0.61)
  Top 0.254: v27.94,3.43 IC6.25
  Bottom 0.254: v27.94,3.43 34.04,3.43 IC3.2
COD2I  (via drill 0.61)
  Top 0.254: v21.34,8.89 19.05,6.6 IC6.18 19.05,5.71
  Bottom 0.254: v21.34,8.89 21.84,8.38 30.35,8.38 31.11,7.62 33.4,7.62 34.04,8.26 IC3.6
COD3A  (via drill 0.61)
  Top 0.254: v38.35,44.2 37.97,43.81 37.97,25.02 39.24,23.75 39.24,13.84 37.34,11.94 37.34,5.33 36.83,4.83 33.15,4.83 v32.89,4.57 | v21.34,7.49 20.32,6.48 IC6.19
  Bottom 0.254: IC4.12 39.24,45.09 v38.35,44.2 | v32.89,4.57 24.26,4.57 v21.34,7.49
COD3B  (via drill 0.61)
  Top 0.254: v25.53,19.68 22.48,16.64 22.48,7.24 21.84,6.6 IC6.20
  Bottom 0.254: v25.53,19.68 28.07,22.23 30.48,22.23 41.15,32.64 41.15,36.32 39.5,37.97 37.59,37.97 33.53,42.04 33.53,43.56 34.04,43.56 IC4.2
COD4A  (via drill 0.61)
  Top 0.254: v38.35,23.24 38.73,22.86 38.73,14.1 36.83,12.19 36.83,8.13 35.94,7.24 IC6.29
  Bottom 0.254: v38.35,23.24 44.45,29.34 45.72,29.34 46.35,29.97 46.35,39.5 41.53,39.5 37.47,43.56 37.47,49.91 40.26,49.91 IC4.8
COD4B  (via drill 0.61)
  Top 0.254: v29.59,13.59 29.59,13.34 30.61,12.32 30.61,7.49 31.5,6.6 IC6.28 | v37.34,14.48 38.23,15.37 38.23,21.97 37.47,22.73 37.47,44.7 v38.35,45.59
  Bottom 0.254: v29.59,13.59 30.48,14.48 v37.34,14.48 | v38.35,45.59 40.13,47.37 40.26,47.37 IC4.10
CPLDRST  (via drill 0.61)
  Top 0.254: v31.37,19.68 32.38,19.68 IC6.39
  Bottom 0.254: C13.1 30.1,17.14 30.1,18.8 R17.1 30.48,19.68 v31.37,19.68
DIR1  (via drill 0.61)
  Top 0.254: v13.21,29.97 14.61,31.37 14.61,38.1 15.88,38.1 IC1.14 | v10.67,27.94 10.03,27.3 PWM.10
  Bottom 0.254: v13.21,29.97 11.18,27.94 v10.67,27.94
DIR2  (via drill 0.61)
  Top 0.254: v13.21,26.8 16.13,29.72 16.13,34.92 17.4,36.2 17.4,37.34 16.89,37.34 IC1.15 | v10.67,25.4 10.03,24.77 PWM.8
  Bottom 0.254: v13.21,26.8 11.81,25.4 v10.67,25.4
DIR3  (via drill 0.61)
  Top 0.254: v14.99,45.97 15.88,45.97 IC1.4 | PWM.1 v5.84,15.24 | v18.29,44.96 18.67,44.58 18.67,39.62 18.16,39.12 18.16,36.2 16.64,34.67 16.64,23.62 v13.84,20.83
  Bottom 0.254: v14.99,45.97 16.38,44.58 17.91,44.58 v18.29,44.96 | v5.84,15.24 5.84,16.51 10.41,20.83 v13.84,20.83
DIR4  (via drill 0.61)
  Top 0.254: v17.78,47.62 17.78,45.85 17.27,45.34 16.89,45.34 IC1.5 | PWM.3 v5.84,17.78
  Bottom 0.254: v17.78,47.62 16,49.4 7.24,49.4 3.3,45.47 3.3,17.78 v5.84,17.78
GND  (via drill 0.61)
  Top 0.254: 36.58,62.1 IC2.18 36.45,62.1 36.45,61.72 36.39,61.66 | 25.02,1.4 30.35,1.4 31.88,2.92 36.45,2.92 C11.2 | 25.02,1.4 21.34,1.4 SV1.1 | 25.02,1.4 25.02,2.79 C19.2 25.4,3.3 IC6.23 25.65,6.6 v25.65,10.67 | PWM.5 4.95,20.95 6.48,20.95 PWM.6 10.03,20.95 10.92,20.07 v10.92,19.94 | C18.2 35.18,9.53 34.04,9.53 IC6.31 32.38,9.91 v31.5,9.91 | v21.46,16.38 18.41,16.38 IC6.10 | v22.61,36.2 22.23,35.81 22.23,35.31 IC1.22 | v10.03,31.11 4.95,31.11 MP.1 | v4.19,44.58 4.19,47.62 PC.1 | v11.05,36.45 10.03,37.47 MP.6 | v38.1,51.82 C20.2 | 35.18,61.59 33.53,61.59 33.4,61.72 33.4,62.1 IC2.13 | 35.18,61.59 35.18,62.1 IC2.16 | 36.39,61.66 36.32,61.59 35.18,61.59 | IC2.1 37.97,68.33 40.51,68.33 C15.- 40.51,67.94 40.51,66.93 39.75,66.17 C5.2 | PWLED.C 35.18,75.31 42.8,75.31 42.8,75.06 SUPPLY.1 | v36.45,61.21 36.45,61.59 36.39,61.66 | v22.23,76.45 24.77,73.91 DEV.10 25.65,73.03 26.8,71.88 26.8,67.94 ANA.1 | IC1.63 18.92,50.8 18.92,51.69 C10.2 18.92,52.45 18.92,66.17 19.43,66.67 LED1.A 21.21,67.44 21.97,67.44 LED2.A 23.75,67.44 26.54,67.44 ANA.1 | IC1.53 26.8,50.8 26.8,52.32 C9.2 26.8,53.09 26.8,58.67 29.84,61.72 29.84,65.91 29.08,66.67 ANA.1
  Top 0.508: COD4.1 44.45,54.48 45.97,56.01 45.97,61.72 44.2,63.5 44.2,64.14 | SUPPLY.1 43.18,69.98 41.78,68.58 C15.- 44.2,66.15 44.2,64.14 | 44.2,64.14 C16.2
  Bottom 0.254: C12.2 22.48,17.02 | C12.2 22.61,17.4 23.5,16.51 28.07,16.51 28.32,16.76 C13.2 | v21.46,16.38 22.1,17.02 C12.2 | 31.5,10.29 25.91,10.29 25.59,10.6 | 31.5,10.29 33.78,10.29 34.04,10.03 IC3.7 | 24.7,11.49 21.72,14.48 21.72,16 v21.46,16.38 | 25.59,10.6 24.7,11.49 | 31.5,10.29 v31.5,9.91 | v10.92,19.94 14.48,16.64 21.08,16.64 v21.46,16.38 | v25.65,10.67 25.59,10.6 | 22.48,31.62 27.56,31.62 C7.1 | 22.48,31.62 19.43,31.62 C6.1 18.67,31.11 14.61,31.11 | 22.48,36.2 22.48,31.62 | 22.48,36.2 22.48,37.72 C8.2 27.05,38.1 28.07,37.08 30.61,37.08 33.02,39.5 33.02,44.83 34.04,44.83 IC4.3 34.04,45.34 33.53,45.85 33.53,47.37 34.04,47.37 IC4.5 34.04,47.88 33.53,48.39 33.53,49.91 34.04,49.91 IC4.7 35.94,50.42 36.7,50.42 v38.1,51.82 38.48,52.07 41.91,55.5 42.04,55.5 42.1,55.56 | 22.48,36.2 v22.61,36.2 | 14.61,31.11 v10.03,31.11 9.78,31.5 4.19,31.5 v4.19,44.58 | v11.05,36.45 12.32,35.18 14.1,35.18 14.61,34.67 14.61,31.11 | 42.1,55.56 42.67,54.99 43.05,54.99 COD4.1 | 42.1,55.56 v36.45,61.21 | v22.23,76.45 9.4,76.45 9.4,73.15 6.22,69.98 4.7,69.98 4.7,67.31 I2C.3 | ANA.1 31.11,70.48 31.88,70.48 32.26,70.87 C3.2 | SUPPLY.1 42.55,72.52 42.29,72.26 33.27,72.26 33.27,71.63 C3.2 | C3.2 33.15,70.87 | 24.7,11.49 25.91,12.7 COD1.1
  Bottom 0.508: COD1.1 45.72,12.7 46.99,13.97 46.99,26.67 | 46.99,26.67 COD2.1 | 46.99,26.67 46.99,40.64 | 46.99,40.64 COD3.1 | 46.99,40.64 46.99,54.61 COD4.1
  other vias: 23.5,26.04 18.03,25.27 24.51,38.61 28.45,36.58 34.92,56.26 9.91,76.58 28.07,59.05 40.39,27.56 39.62,33.53 13.84,22.73 15.24,27.18 19.18,56.77
  pour Bottom (isolate 0.254): 0,78.74 48.26,78.74 48.26,0 0,0
  pour Top (isolate 0.254): 0,78.74 48.26,78.74 48.26,0 0,0
INT  (via drill 0.61)
  Top 0.254: v12.45,71.5 12.45,66.17 11.81,65.53 11.81,46.86 13.72,44.96 13.72,42.16 15.88,42.16 IC1.9
  Bottom 0.254: v12.45,71.5 11.94,72.01 9.91,72.01 6.35,68.45 6.35,65.53 2.54,65.53 I2C.2
MC1+
  Top 0.254: IC2.2 37.21,68.71 37.21,70.87 C1.2
MC1-
  Top 0.254: IC2.4 35.81,68.71 35.81,69.22 35.43,69.6 35.43,70.48 35.56,70.61 35.56,70.87 C1.1
MC2+
  Top 0.254: IC2.5 35.18,68.71 35.18,69.09 34.92,69.34 34.92,70.87 C2.2
MC2-  (via drill 0.61)
  Top 0.254: v36.32,67.06 36.32,67.18 35.05,67.18 34.67,67.56 34.67,67.94 IC2.6 | v30.99,68.33 30.61,68.71 30.61,69.22 32.26,70.87 C2.1
  Bottom 0.254: v36.32,67.06 35.05,68.33 v30.99,68.33
MISO  (via drill 0.61)
  Top 0.254: v14.61,38.99 15.88,38.99 IC1.13 | MP.7 v5.84,39.37
  Bottom 0.254: v14.61,38.99 14.22,39.37 v5.84,39.37
MOSI  (via drill 0.61)
  Top 0.254: v13.72,34.29 13.72,39.88 15.88,39.88 IC1.12 | MP.3 v5.84,34.29
  Bottom 0.254: v5.84,34.29 v13.72,34.29
MV+  (via drill 0.61)
  Top 0.254: v36.32,69.98 36.45,69.85 36.45,68.71 IC2.3
  Bottom 0.254: v36.32,69.98 36.32,70.87 C4.1
MV-  (via drill 0.61)
  Top 0.254: v34.04,69.98 34.04,68.71 IC2.7
  Bottom 0.254: v34.04,69.98 34.04,70.87 C3.1
N$1
  Top 0.254: R7.1 32.26,74.17 32.26,75.31 PWLED.A
N$2
  Top 0.254: R8.2 22.35,60.33 21.34,59.31 21.34,50.8 IC1.60
N$4  (via drill 0.61)
  Top 0.254: v22.99,59.44 23.11,59.31 23.11,52.96 22.99,52.83 22.99,50.8 IC1.58
  Bottom 0.254: v22.99,59.44 24.13,60.58 25.27,60.58 26.54,61.85 ANA.3
N$5  (via drill 0.61)
  Top 0.254: v22.23,53.34 22.23,50.8 IC1.59
  Bottom 0.254: v22.23,53.34 23.88,54.99 29.97,54.99 30.48,55.5 30.48,64.14 29.08,64.14 ANA.2
N$6
  Top 0.254: IC6.11 16.76,14.61 14.61,14.61 14.1,14.1 14.1,5.46 13.34,4.7 10.54,4.7 10.16,4.32 SV1.5
N$7
  Top 0.254: IC6.12 16.76,13.34 15.11,13.34 14.61,12.83 14.61,5.08 12.7,3.17 SV1.4
N$8  (via drill 0.61)
  Top 0.254: R10.1 COD3.3 45.59,36.2 46.35,36.96 46.35,41.15 v45.34,42.16
  Bottom 0.254: v45.34,42.16 43.56,42.16 42.16,43.56 IC4.13
N$9
  Top 0.254: IC6.13 16.76,12.06 15.62,12.06 15.11,11.56 15.11,3.94 SV1.3
N$10
  Top 0.254: R11.1 COD3.5
  Bottom 0.254: IC4.1 35.94,42.29 42.55,35.69 42.55,31.11 43.31,31.11 COD3.5
N$11
  Top 0.254: IC1.24 23.88,34.29 23.88,32.89 25.65,31.11 Q1.1
  Bottom 0.254: C7.2 27.56,30.1 26.42,30.1 Q1.1
N$12
  Top 0.254: R12.1 COD3.2
N$13
  Top 0.254: IC6.14 16.76,10.79 16.13,10.79 15.62,10.29 15.62,5.08 17.78,2.92 SV1.2
N$14
  Top 0.254: R8.1 LED2.C
N$15
  Top 0.254: R9.2 20.45,60.33 20.45,50.8 IC1.61
N$16
  Top 0.254: R9.1 LED1.C
N$18  (via drill 0.61)
  Top 0.254: COD2.2 R1.1 | v29.21,7.49 27.56,9.14 27.56,19.18 v27.05,19.68
  Bottom 0.254: v29.21,7.49 29.59,7.11 34.04,7.11 IC3.5 | v27.05,19.68 28.83,21.46 40.77,21.46 43.43,24.13 COD2.2
N$19
  Top 0.254: COD1.2 R4.1
  Bottom 0.254: IC3.9 42.16,8.51 43.18,9.53 43.31,9.53 COD1.2
N$21
  Top 0.254: COD1.3 R6.1
  Bottom 0.254: IC3.11 42.16,5.97 43.18,6.99 43.31,6.99 COD1.3
N$22
  Top 0.254: R5.1 COD1.5
  Bottom 0.254: IC3.13 42.16,2.92 43.05,2.92 COD1.5
N$23  (via drill 0.61)
  Top 0.254: COD2.3 R3.1 | v23.88,7.49 v23.88,13.59
  Bottom 0.254: v23.88,7.49 25.91,5.46 33.27,5.46 34.04,4.7 IC3.3 | v23.88,13.59 25.65,15.37 40.89,15.37 43.43,17.91 45.72,17.91 46.35,18.54 46.35,20.95 45.59,20.95 COD2.3
N$24  (via drill 0.61)
  Top 0.254: COD2.5 R2.1 41.66,16 41.66,14.35 39.5,12.19 39.5,5.59 v39.37,5.46
  Bottom 0.254: v39.37,5.46 36.32,2.41 36.2,2.41 35.94,2.16 IC3.1
N$32
  Top 0.254: R13.1 COD4.3
  Bottom 0.254: IC4.9 42.16,49.15 43.05,49.15 COD4.3
N$33
  Top 0.254: R14.1 COD4.5
  Bottom 0.254: IC4.11 42.16,46.1 43.18,45.09 43.31,45.09 COD4.5
N$41
  Top 0.254: R15.1 COD4.2
PD4
  Top 0.254: IC1.29 27.67,34.05 29.84,31.88 29.84,29.84 24.26,24.26 22.73,24.26 21.59,23.11 IC6.4 21.59,21.21
PD5
  Top 0.254: IC1.30 28.46,34.02 30.35,32.13 30.35,29.59 24.51,23.75 23.24,23.75 22.86,23.37 IC6.3 22.86,21.34
PD6
  Top 0.254: IC1.31 29.25,34 30.86,32.38 30.86,29.34 24.77,23.24 24.13,23.24 IC6.2
PD7
  Top 0.254: IC1.32 30.04,33.97 31.37,32.64 31.37,29.08 25.4,23.11 IC6.1
PDI/RX0/TDI  (via drill 0.61)
  Top 0.254: v10.92,65.41 11.56,66.04 11.56,71.75 11.18,72.14 11.18,73.03 12.57,74.42 14.1,74.42 14.1,72.64 14.99,71.75 DEV.1 15.11,70.48 15.11,52.07 v14.86,51.69 14.1,50.93 14.1,48.13 14.61,47.62 15.88,47.62 IC1.2
  Bottom 0.254: v10.92,65.41 14.1,65.41 14.1,65.91 JCI.2 | v14.86,51.69 16.26,51.69 22.48,45.47 22.73,45.47 22.73,41.91 22.23,41.4 9.78,41.4 9.53,41.15 R16.2
PDO/TX0/TDO  (via drill 0.61)
  Top 0.254: 13.72,46.86 15.88,46.86 IC1.3 | v13.72,46.23 13.72,46.86 | v10.16,44.7 10.03,44.58 10.03,43.81 MP.10 | 13.72,46.86 13.59,46.99 13.59,57.91 13.21,58.29 13.21,60.71 v13.59,61.09 | v24.77,61.59 25.15,61.98 v25.15,66.55
  Bottom 0.254: v13.72,46.23 12.19,44.7 v10.16,44.7 | JCO.2 15.11,69.34 15.11,69.98 23.88,69.98 24.77,70.87 DEV.9 25.15,70.48 v25.15,66.55 | v13.59,61.09 24.26,61.09 v24.77,61.59
PWM1  (via drill 0.61)
  Top 0.254: v15.11,29.97 15.11,35.69 15.88,36.45 IC1.16 | PWM.9 v5.84,25.4
  Bottom 0.254: v15.11,29.97 11.81,26.67 7.11,26.67 v5.84,25.4
PWM2  (via drill 0.61)
  Top 0.254: v17.91,27.94 17.91,34.16 18.03,34.29 IC1.17 | PWM.7 v5.84,22.86
  Bottom 0.254: v17.91,27.94 14.1,24.13 7.11,24.13 v5.84,22.86
PWM3  (via drill 0.61)
  Top 0.254: v14.61,43.05 14.61,44.45 15.88,44.45 IC1.6 | v12.83,42.8 11.94,41.91 11.94,35.69 11.37,35.12 | 11.37,35.12 11.3,35.05 10.03,35.05 MP.4 | PWM.2 10.03,17.14 12.32,17.14 12.32,34.16 11.37,35.12
  Bottom 0.254: v14.61,43.05 14.35,42.8 v12.83,42.8
PWM4  (via drill 0.61)
  Top 0.254: v17.78,43.69 16.89,43.69 IC1.7 | v5.59,33.02 MP.2 10.03,32.38 11.81,30.61 11.81,19.05 PWM.4
  Bottom 0.254: v17.78,43.69 17.53,43.94 10.67,43.94 10.54,43.81 6.48,43.81 5.97,44.32 5.21,44.32 4.7,43.81 4.7,33.02 v5.59,33.02
RD  (via drill 0.61)
  Top 0.254: IC6.42 v29.21,23.62 | IC1.34 31.08,37.43 30.73,37.08 30.73,36.32 31.11,35.94 31.62,35.94 31.88,35.69 31.88,28.83 30.1,27.05 v30.1,25.91
  Bottom 0.254: v29.21,23.62 29.21,25.02 v30.1,25.91
RX  (via drill 0.61)
  Top 0.254: R19.2 32.64,66.67 32.64,67.94 IC2.9 32.77,68.71 v32.77,69.6 | v38.1,69.98 38.73,70.61 v38.73,73.15
  Bottom 0.254: v32.77,69.6 33.27,69.09 37.21,69.09 v38.1,69.98 | v38.73,73.15 37.08,74.8 19.3,74.8 18.41,73.91 DEV.4
RX1  (via drill 0.61)
  Top 0.254: IC1.27 26.1,44.39 v29.46,47.75 | IC2.10 31.88,67.94 31.37,67.44 31.37,65.53 31.88,65.02 R19.1 31.88,64.14 31.37,63.63 v31.37,52.83
  Bottom 0.254: v29.46,47.75 29.97,48.26 29.97,50.04 31.37,51.44 v31.37,52.83
SCK  (via drill 0.61)
  Top 0.254: v12.83,38.48 12.83,40.51 15.88,40.51 IC1.11 16.89,40.51 v17.78,40.51 | v5.59,38.1 4.95,37.47 MP.5 | v15.88,50.8 15.88,61.98 16.38,62.48 16.38,74.8 20.83,74.8 21.46,74.17 21.46,72.9 22.61,71.75 DEV.7 | v20.07,40.51 v20.07,46.61
  Bottom 0.254: v12.83,38.48 12.45,38.1 v5.59,38.1 | v20.07,46.61 v15.88,50.8 | v17.78,40.51 v20.07,40.51
SCL  (via drill 0.61)
  Top 0.254: 3.3,67.94 R21.1 | 3.3,67.94 I2C.4 | v21.46,39.37 21.46,38.61 24.38,35.69 24.38,35.31 IC1.25 | v11.05,40.51 11.05,60.07 8.13,62.99 3.3,62.99 3.3,67.94
  Bottom 0.254: v21.46,39.37 21.21,39.62 15.24,39.62 14.35,40.51 v11.05,40.51
SDA  (via drill 0.61)
  Top 0.254: I2C.1 R20.1 | v25.65,26.92 27.05,28.32 27.05,30.86 25.4,32.51 25.4,34.29 IC1.26 | v38.86,36.58 39.24,36.96 v39.24,62.48 | v10.29,72.9 v10.29,71.12
  Bottom 0.254: v25.65,26.92 26.8,28.07 30.35,28.07 v38.86,36.58 | v39.24,62.48 46.86,70.1 46.86,75.56 12.95,75.56 v10.29,72.9 | v10.29,71.12 10.29,70.74 6.86,67.31 6.86,64.77 4.7,64.77 I2C.1
SS  (via drill 0.61)
  Top 0.254: v17.78,42.29 17.78,41.4 16.89,41.4 IC1.10 | v5.59,43.43 4.95,42.8 4.95,42.55 MP.9
  Bottom 0.254: v17.78,42.29 17.4,41.91 7.11,41.91 v5.59,43.43
TCK  (via drill 0.61)
  Top 0.254: v17.14,61.98 17.53,62.36 17.53,70.48 DEV.3
  Bottom 0.254: v17.14,61.98 15.11,61.98 15.11,62.74 JCC.2
TMS  (via drill 0.61)
  Top 0.254: v19.3,8.89 18.92,8.51 IC6.16 | v24.77,58.67 24.64,58.55 24.64,50.8 IC1.56 | v18.03,60.2 18.41,60.58 18.41,70.1 19.18,70.87 19.18,72.14 20.07,73.03 DEV.6 | v3.81,60.2 3.81,61.47 v1.78,63.5
  Bottom 0.254: v19.3,8.89 18.92,9.27 2.41,9.27 1.14,10.54 1.14,62.87 v1.78,63.5 | v24.77,58.67 24.64,58.55 19.68,58.55 v18.03,60.2 9.91,60.2 9.53,60.58 4.19,60.58 v3.81,60.2
TX  (via drill 0.61)
  Top 0.254: IC2.8 33.4,67.94 33.4,67.56 34.42,66.55 R18.2 35.43,65.79 v36.32,65.79
  Bottom 0.254: v36.32,65.79 35.94,66.17 26.67,66.17 26.04,66.8 26.04,70.1 26.54,70.61 26.54,72.52 24.38,72.52 23.5,73.41 DEV.8
TX1  (via drill 0.61)
  Top 0.254: IC1.28 26.89,43.9 v29.34,46.35 | R18.1 34.42,64.9 32.77,63.25 32.77,62.87 IC2.12 32.64,62.1 v32.64,51.94
  Bottom 0.254: v29.34,46.35 29.84,46.86 32.64,46.86 v32.64,51.94
TX_SLAVE  (via drill 0.61)
  Top 0.254: v5.84,41.91 6.48,41.27 MP.8
  Bottom 0.254: v5.84,41.91 6.22,41.91 6.99,41.15 R16.1
WR  (via drill 0.61)
  Top 0.254: IC1.33 32.19,36.64 32.38,36.45 32.38,27.81 v31.88,27.3 | v20.95,18.8 20.19,18.8 19.05,19.94 IC6.7 17.53,19.94
  Bottom 0.254: v31.88,27.3 29.21,27.3 22.23,20.57 21.84,20.57 21.34,20.07 21.34,19.18 v20.95,18.8
XTCK  (via drill 0.61)
  Top 0.254: v20.83,10.67 20.45,10.29 20.45,8.76 18.92,7.24 IC6.17 17.53,7.24
  Bottom 0.254: v20.83,10.67 19.94,11.56 19.18,11.56 18.41,10.79 3.17,10.79 2.67,11.3 2.67,60.83 2.92,61.09 10.67,61.09 JCC.3
XTDI  (via drill 0.61)
  Top 0.254: v19.56,10.67 18.67,9.78 IC6.15
  Bottom 0.254: v19.56,10.67 19.18,10.29 2.92,10.29 2.16,11.05 2.16,61.09 2.67,61.59 8.89,61.59 12.19,64.77 15.49,64.77 16.13,65.41 JCI.3
XTDO  (via drill 0.61)
  Top 0.254: v31.5,8.51 IC6.30
  Bottom 0.254: v31.5,8.51 30.23,9.78 2.67,9.78 1.65,10.79 1.65,61.34 2.41,62.1 8.26,62.1 8.26,67.94 8.89,68.58 JCO.3

### Text on the board
Top: asserv | 2008
Bottom: APB | 08
_tSilk: PW | SUPPLY | DEV | I2C | LED1 | LED2 | ANA | PC | COD4 | COD3 | MP | asserv-2 | APBTeam 2008 | COD2 | PWM | COD1 | D